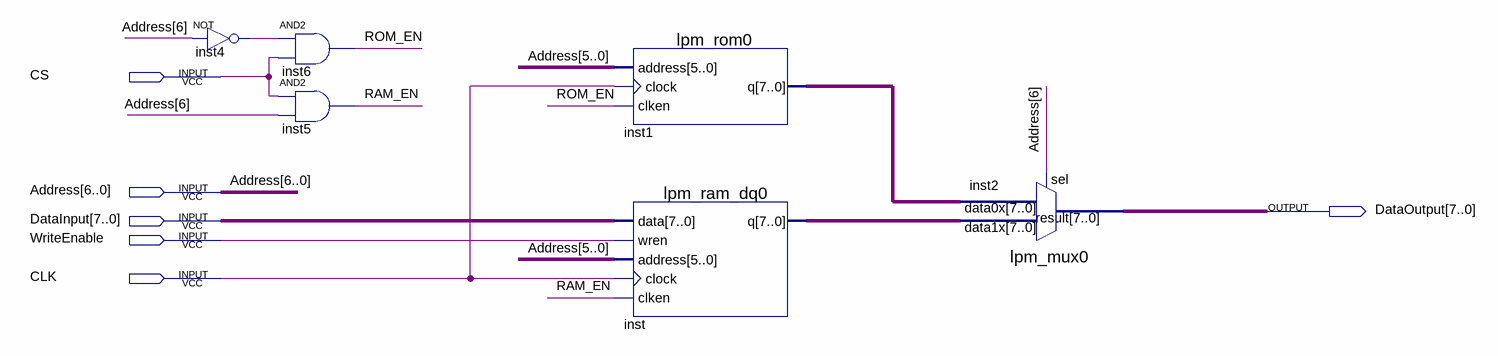
[diagram p0: schematic sheet]
// Quartus schematic MEM.bdf as structural Verilog: 6 symbols, 6 pins
module MEM (
  input  CS,
  input  [6:0] Address,
  input  [7:0] DataInput,
  input  WriteEnable,
  input  CLK,
  output [7:0] DataOutput
);

  wire inst4_out, RAM_EN, ROM_EN;
  wire [7:0] inst1_q, inst_q;

  not inst4 (inst4_out, Address[6]);
  and inst6 (ROM_EN, inst4_out, CS);
  and inst5 (RAM_EN, CS, Address[6]);
  lpm_rom0 inst1 (.address(Address[5:0]), .clock(CLK), .clken(ROM_EN), .q(inst1_q));
  lpm_ram_dq0 inst (
    .data(DataInput), .wren(WriteEnable), .address(Address[5:0]), .clock(CLK), .clken(RAM_EN), .q(inst_q));
  lpm_mux0 inst2 (.data1x(inst_q), .data0x(inst1_q), .sel(Address[6]), .result(DataOutput));
endmodule
